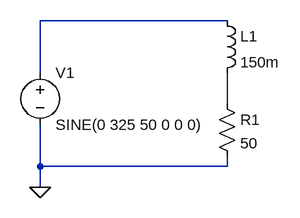
[diagram p0: schematic EEE_10.asc]
EEE_10.asc, the LTspice schematic file:
Version 4
SHEET 1 880 680
WIRE 288 48 0 48
WIRE 0 128 0 48
WIRE 288 176 288 128
WIRE 0 272 0 208
WIRE 288 272 288 256
WIRE 288 272 0 272
WIRE 0 304 0 272
FLAG 0 304 0
SYMBOL voltage 0 112 R0
WINDOW 123 0 0 Left 0
WINDOW 39 0 0 Left 0
SYMATTR InstName V1
SYMATTR Value SINE(0 325 50 0 0 0)
SYMBOL ind 272 32 R0
SYMATTR InstName L1
SYMATTR Value 150m
SYMBOL res 272 160 R0
SYMATTR InstName R1
SYMATTR Value 50

The netlist it stands for:
* EEE_10.asc
V1 N001 0 SINE(0 325 50 0 0 0)
L1 N001 N002 150m
R1 N002 0 50
.backanno
.end